# EAGLE design vixen1 (EAGLE 7.7.0)
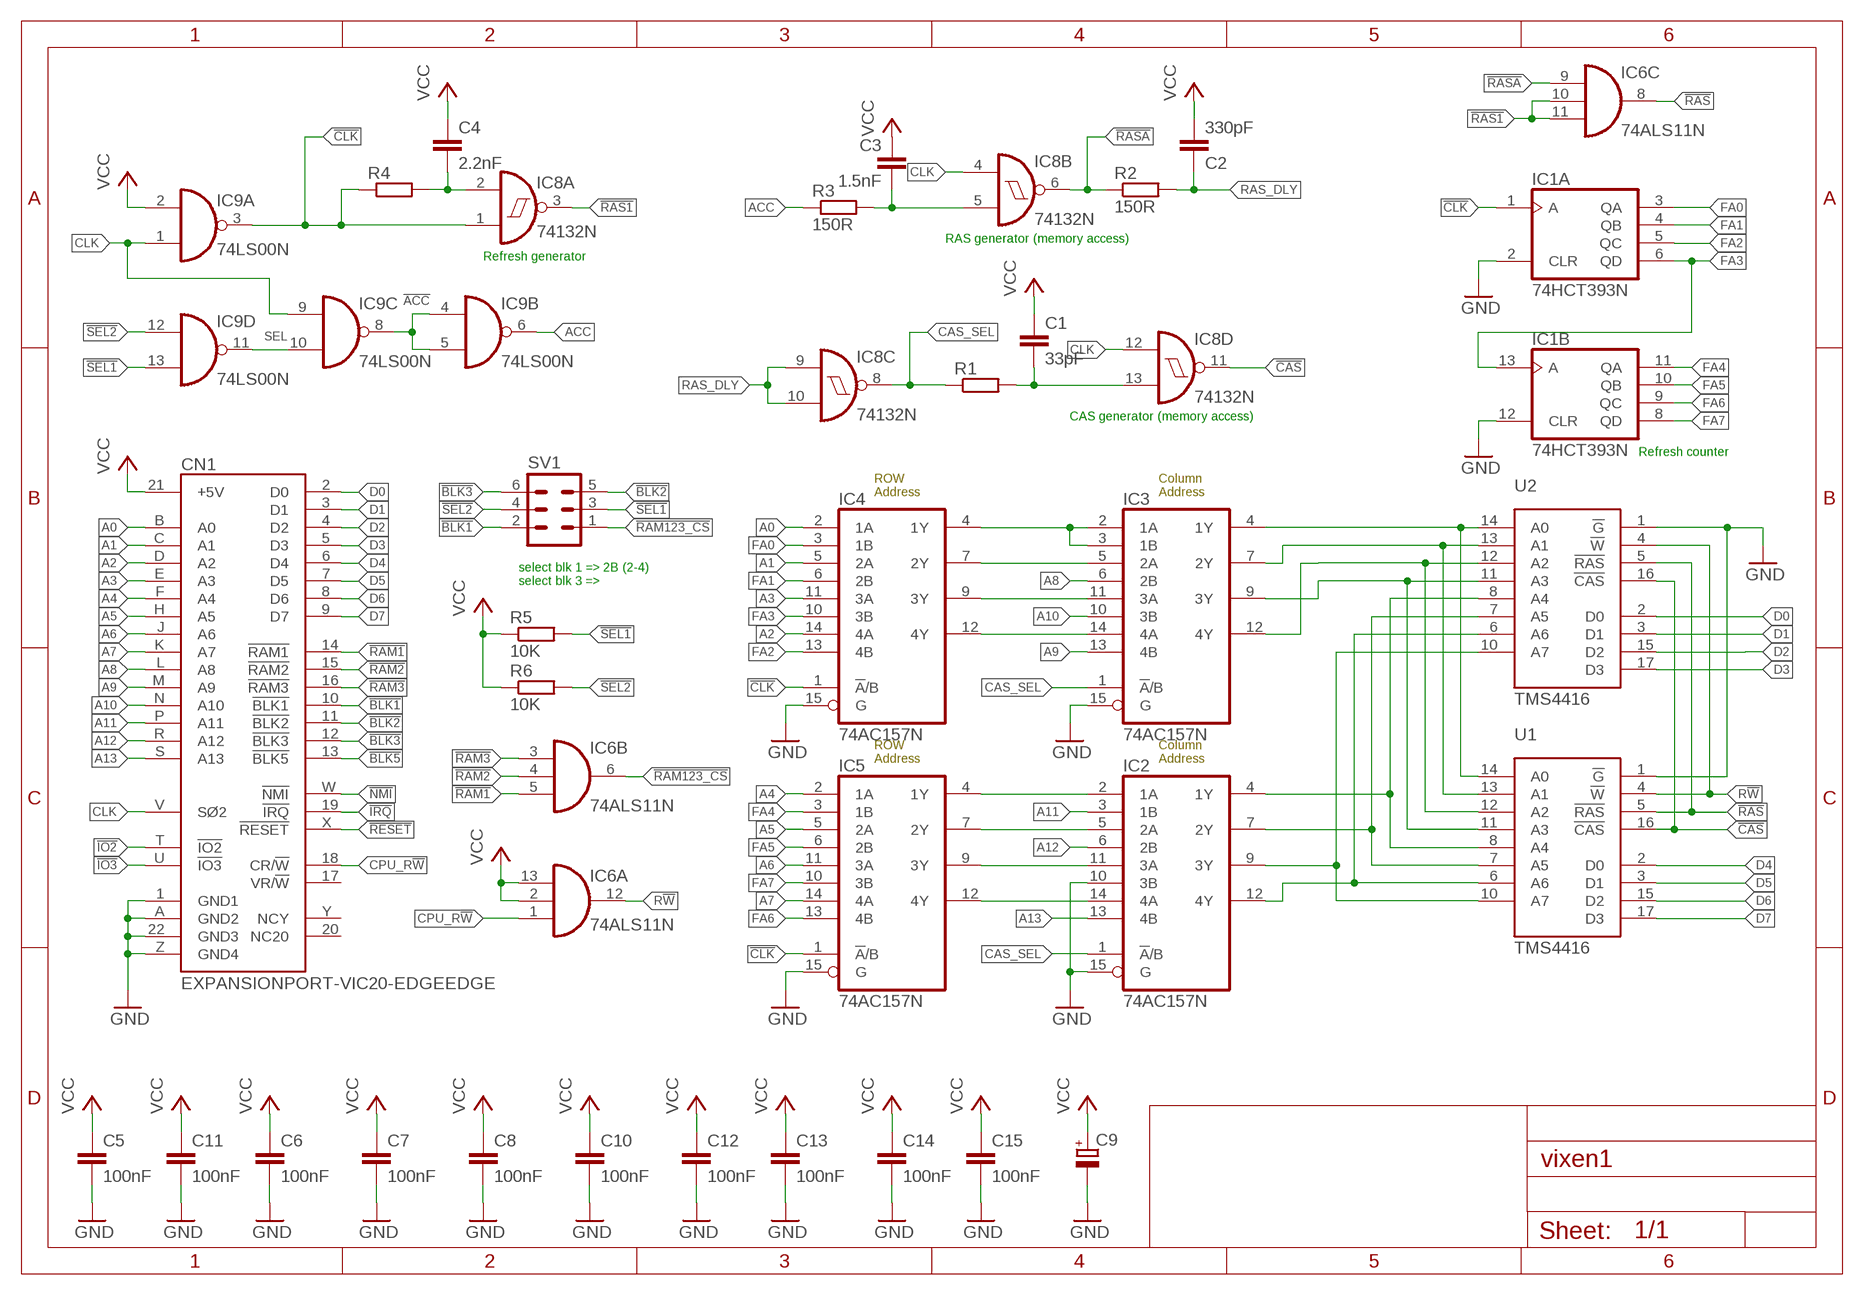
[diagram p0: schematic, sheet 1]

## Parts
C1  33pF  C-EU025-025X050  [C025-025X050]
C2  330pF  C-EU025-025X050  [C025-025X050]
C3  1.5nF  C-EU025-025X050  [C025-025X050]
C4  2.2nF  C-EU025-025X050  [C025-025X050]
C5  100nF  C-EU025-025X050  [C025-025X050]
C6  100nF  C-EU025-025X050  [C025-025X050]
C7  100nF  C-EU025-025X050  [C025-025X050]
C8  100nF  C-EU025-025X050  [C025-025X050]
C9  CPOL-EUE15-5AXIAL  [E15-5]
C10  100nF  C-EU025-025X050  [C025-025X050]
C11  100nF  C-EU025-025X050  [C025-025X050]
C12  100nF  C-EU025-025X050  [C025-025X050]
C13  100nF  C-EU025-025X050  [C025-025X050]
C14  100nF  C-EU025-025X050  [C025-025X050]
C15  100nF  C-EU025-025X050  [C025-025X050]
CN1  EXPANSIONPORT-VIC20-EDGEEDGE  [UPS44EDGE]
IC1  74HCT393N  [DIL14]
IC2  74AC157N  [DIL16]
IC3  74AC157N  [DIL16]
IC4  74AC157N  [DIL16]
IC5  74AC157N  [DIL16]
IC6  74ALS11N  [DIL14]
IC8  74132N  [DIL14]
IC9  74LS00N  [DIL14]
R1  R-EU_0204/7  [0204/7]
R2  150R  R-EU_0204/7  [0204/7]
R3  150R  R-EU_0204/7  [0204/7]
R4  R-EU_0204/7  [0204/7]
R5  10K  R-EU_0204/7  [0204/7]
R6  10K  R-EU_0204/7  [0204/7]
SV1  MA03-2  [MA03-2]
U1  TMS4416  [DIL18]
U2  TMS4416  [DIL18]

## Nets
!ACC: IC9.4(B:I0) IC9.5(B:I1) IC9.8(C:O)
!BLK1: CN1.10(!BLK1) SV1.2
!BLK2: CN1.11(!BLK2) SV1.5
!BLK3: CN1.12(!BLK3) SV1.6
!BLK5: CN1.13(!BLK5)
!CAS: IC8.11(D:O) U1.16(!CAS) U2.16(!CAS)
!CLK: IC1.1(A:A) IC4.1(!A!/B) IC5.1(!A!/B) IC8.1(A:I0) IC9.3(A:O) R4.1
!IO2: CN1.T(!IO2)
!IO3: CN1.U(!IO3)
!IRQ: CN1.19(!IRQ)
!NMI: CN1.W(!NMI)
!RAM1: CN1.14(!RAM1) IC6.5(B:I2)
!RAM2: CN1.15(!RAM2) IC6.4(B:I1)
!RAM3: CN1.16(!RAM3) IC6.3(B:I0)
!RAM123_CS: IC6.6(B:O) SV1.1
!RAS: IC6.8(C:O) U1.5(!RAS) U2.5(!RAS)
!RAS1: IC6.10(C:I1) IC6.11(C:I2) IC8.3(A:O)
!RASA: IC6.9(C:I0) IC8.6(B:O) R2.1
!RESET: CN1.X(!RESET)
!SEL1: IC9.13(D:I1) R5.2 SV1.3
!SEL2: IC9.12(D:I0) R6.2 SV1.4
A0: CN1.B(A0) IC4.2(1A)
A1: CN1.C(A1) IC4.5(2A)
A2: CN1.D(A2) IC4.14(4A)
A3: CN1.E(A3) IC4.11(3A)
A4: CN1.F(A4) IC5.2(1A)
A5: CN1.H(A5) IC5.5(2A)
A6: CN1.J(A6) IC5.11(3A)
A7: CN1.K(A7) IC5.14(4A)
A8: CN1.L(A8) IC3.6(2B)
A9: CN1.M(A9) IC3.13(4B)
A10: CN1.N(A10) IC3.10(3B)
A11: CN1.P(A11) IC2.3(1B)
A12: CN1.R(A12) IC2.6(2B)
A13: CN1.S(A13) IC2.13(4B)
ACC: IC9.6(B:O) R3.1
CAS_RC: C1.2 IC8.13(D:I1) R1.2
CAS_RC1: C4.2 IC8.2(A:I1) R4.2
CAS_SEL: IC2.1(!A!/B) IC3.1(!A!/B) IC8.8(C:O) R1.1
CLK: CN1.V(SØ2) IC8.4(B:I0) IC8.12(D:I0) IC9.1(A:I0) IC9.9(C:I0)
CPU_R!W: CN1.18(CR/!W) IC6.1(A:I0)
D0: CN1.2(D0) U2.2(D0)
D1: CN1.3(D1) U2.3(D1)
D2: CN1.4(D2) U2.15(D2)
D3: CN1.5(D3) U2.17(D3)
D4: CN1.6(D4) U1.2(D0)
D5: CN1.7(D5) U1.3(D1)
D6: CN1.8(D6) U1.15(D2)
D7: CN1.9(D7) U1.17(D3)
FA0: IC1.3(A:QA) IC4.3(1B)
FA1: IC1.4(A:QB) IC4.6(2B)
FA2: IC1.5(A:QC) IC4.13(4B)
FA3: IC1.6(A:QD) IC1.13(B:A) IC4.10(3B)
FA4: IC1.11(B:QA) IC5.3(1B)
FA5: IC1.10(B:QB) IC5.6(2B)
FA6: IC1.9(B:QC) IC5.13(4B)
FA7: IC1.8(B:QD) IC5.10(3B)
GND: C5.2 C6.2 C7.2 C8.2 C9.- C10.2 C11.2 C12.2 C13.2 C14.2 C15.2 CN1.1(GND1) CN1.22(GND3) CN1.A(GND2) CN1.Z(GND4) IC1.2(A:CLR) IC1.12(B:CLR) IC2.10(3B) IC2.15(G) IC3.15(G) IC4.15(G) IC5.15(G) U1.1(!G) U2.1(!G)
R!W: IC6.12(A:O) U1.4(!W) U2.4(!W)
RA0: IC3.4(1Y) U1.14(A0) U2.14(A0)
RA1: IC3.7(2Y) U1.13(A1) U2.13(A1)
RA2: IC3.12(4Y) U1.12(A2) U2.12(A2)
RA3: IC3.9(3Y) U1.11(A3) U2.11(A3)
RA4: IC2.4(1Y) U1.8(A4) U2.8(A4)
RA5: IC2.7(2Y) U1.7(A5) U2.7(A5)
RA6: IC2.12(4Y) U1.6(A6) U2.6(A6)
RA7: IC2.9(3Y) U1.10(A7) U2.10(A7)
RAS_DLY: C2.1 IC8.9(C:I0) IC8.10(C:I1) R2.2
RAS_RC1: C3.2 IC8.5(B:I1) R3.2
ROW0: IC3.2(1A) IC3.3(1B) IC4.4(1Y)
ROW1: IC3.5(2A) IC4.7(2Y)
ROW2: IC3.14(4A) IC4.12(4Y)
ROW3: IC3.11(3A) IC4.9(3Y)
ROW4: IC2.2(1A) IC5.4(1Y)
ROW5: IC2.5(2A) IC5.7(2Y)
ROW6: IC2.14(4A) IC5.12(4Y)
ROW7: IC2.11(3A) IC5.9(3Y)
SEL: IC9.10(C:I1) IC9.11(D:O)
VCC: C1.1 C2.2 C3.1 C4.1 C5.1 C6.1 C7.1 C8.1 C9.+ C10.1 C11.1 C12.1 C13.1 C14.1 C15.1 CN1.21(+5V) IC6.2(A:I1) IC6.13(A:I2) IC9.2(A:I1) R5.1 R6.1
Unconnected: CN1.17(VR/!W) CN1.20(NC20) CN1.Y(NCY)

## Notes on the sheet
- RAS generator (memory access)
- Refresh generator
- CAS generator (memory access)
- Refresh counter
- ROW
  Address
- Column
  Address
- select blk 1 => 2B (2-4)
  select blk 3 =>
- ROW
  Address
- Column
  Address

## Power pins joined to a net without a drawn wire
GND: IC1.7(P:GND) IC2.8(GND) IC3.8(GND) IC4.8(GND) IC5.8(GND) IC6.7(P:GND) IC8.7(P:GND) IC9.7(P:GND) U1.18(GND) U2.18(GND)
VCC: IC1.14(P:VCC) IC2.16(VCC) IC3.16(VCC) IC4.16(VCC) IC5.16(VCC) IC6.14(P:VCC) IC8.14(P:VCC) IC9.14(P:VCC) U1.9(VCC) U2.9(VCC)

## Library data of the parts
C1-C8 C10-C15 = rcl:C-EU: CAPACITOR, European symbol
C9 = rcl:CPOL-EU: POLARIZED CAPACITOR, European symbol
CN1 = 0RB_Commodore:EXPANSIONPORT-VIC20-EDGE: Expansionport of the Commodore VIC-20
IC1 = 74xx-eu:74*393: Dual 4-bit decade and binary COUNTER
IC2-IC5 = 74xx-eu:74*157: Quadruple 2-line to 1-line data SELECTOR/MULTIPLEXER
IC6 = 74xx-eu:74*11: Triple 3-input AND gate
IC8 = 74xx-eu:74*132: Quad 2-input NAND schmitt trigger
IC9 = 74xx-eu:74*00: Quad 2-input NAND gate
R1-R6 = rcl:R-EU_: RESISTOR, European symbol
SV1 = con-lstb:MA03-2: PIN HEADER; OC_FARNELL: unknown; OC_NEWARK: unknown
U1 U2 = tms4416:TMS4416

## Board
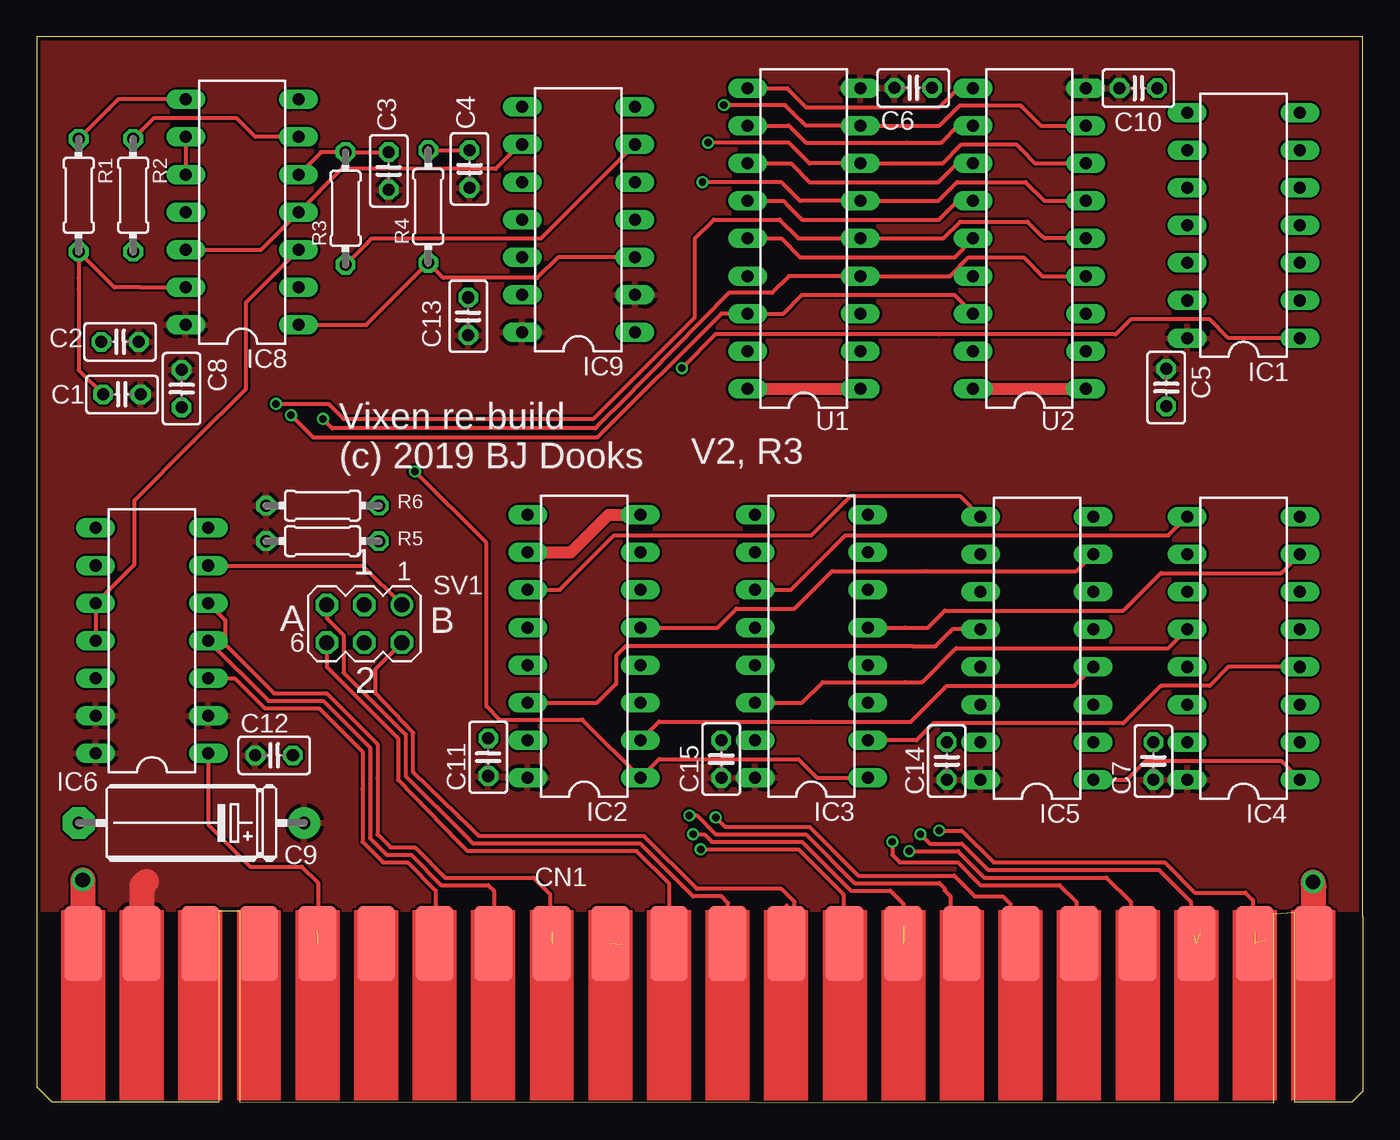
[diagram p1: board, top side]
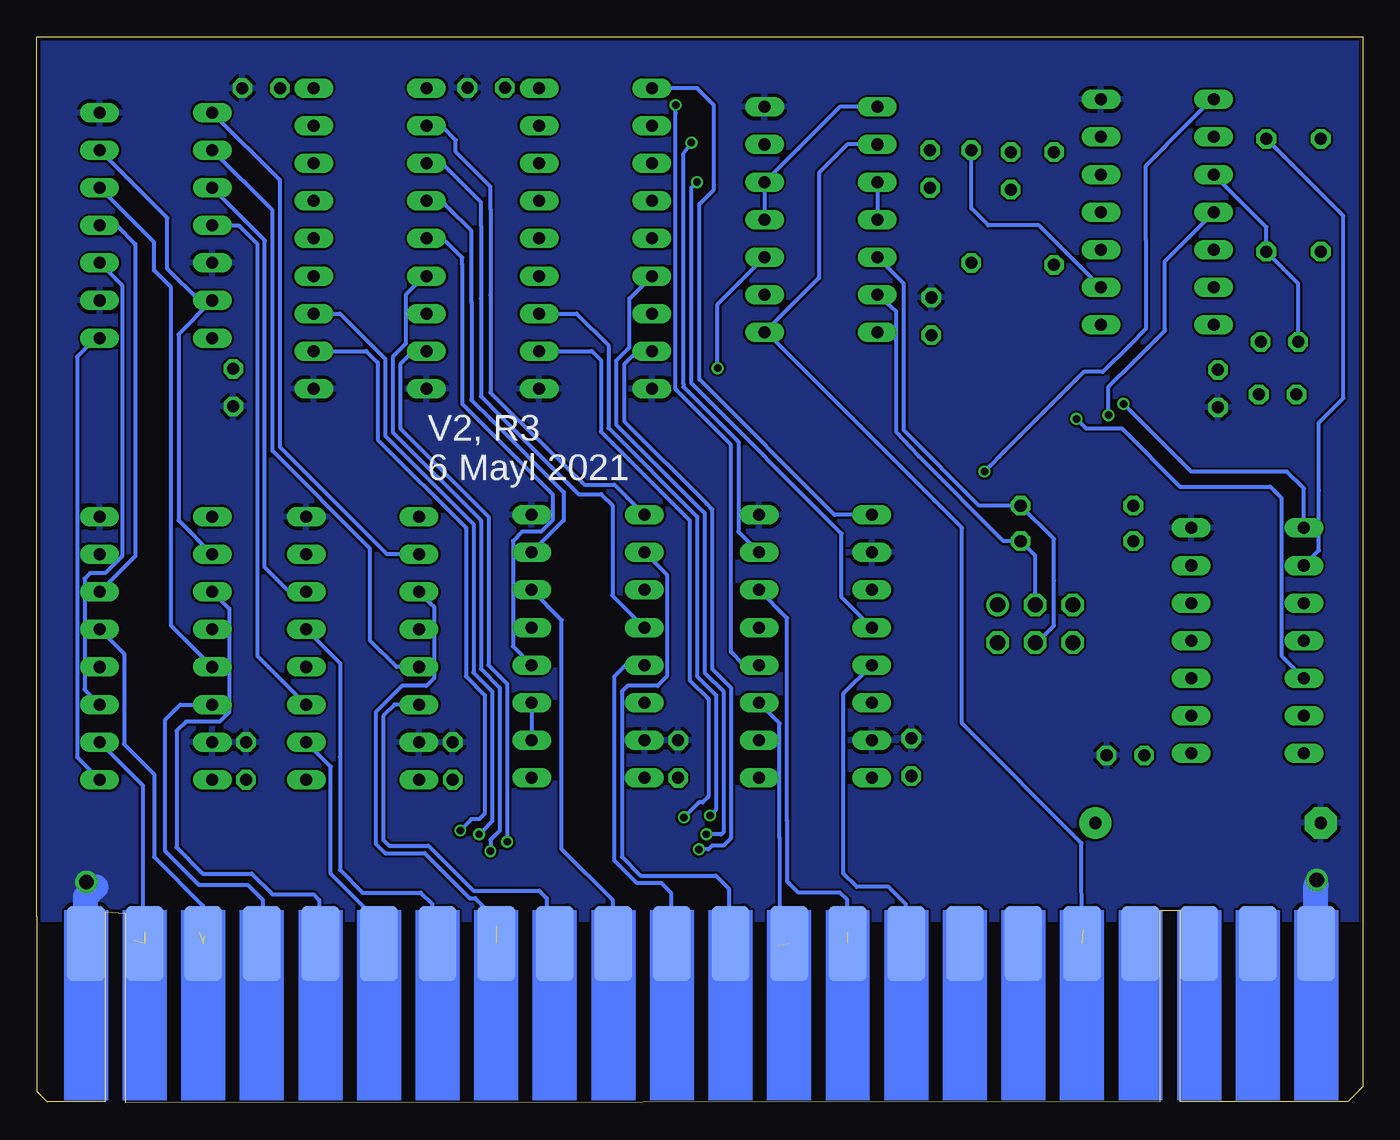
[diagram p2: board, bottom side, seen from below]

Size 89.6 x 72.03 mm. Coordinates in mm from the lower left corner, seen from the top.
Outline: 89.6,12.57 89.6,72.03 0,72.03 0,12.72
Copper layers (1*16): Top 0.035mm / dielectric 1.5mm / Bottom 0.035mm
Design rules "Elecrow_2-layer_eagle_rule *": minimum track width 6mil, minimum drill 12mil, track to track 6mil, track to pad 6mil, pad to pad 6mil, via to via 6mil, smd to smd 0mil, copper to edge 10mil, drill to drill 10mil, minimum pad ring 10mil, minimum via ring 6mil, stop-mask expansion 2mil, vias tented up to drill 100mil, thermal gap 10mil

### Footprints (pad centres in the part's own frame; a part is rotated, then mirrored left to right if it is on the bottom)
C025-025X050 = drill 0.813 octagon: 1 -1.27,0; 2 1.27,0
E15-5 = drill 0.813 pad 2.159: + -7.62,0 | drill 0.813 pad 2.159 octagon: - 7.62,0
UPS44EDGE = smd 2.54 x 5.08: 1 41.581,3.68; 2 37.621,3.68; 3 33.661,3.68; 4 29.701,3.68; 5 25.741,3.68; 6 21.781,3.68; 7 17.821,3.68; 8 13.861,3.68; 9 9.901,3.68; 10 5.941,3.68; 11 1.981,3.68; 12 -1.979,3.68; 13 -5.939,3.68; 14 -9.899,3.68; 15 -13.859,3.68; 16 -17.819,3.68; 17 -21.779,3.68; 18 -25.739,3.68; 19 -29.699,3.68; 20 -33.659,3.68; 21 -37.619,3.68; 22 -41.579,3.68 | smd 2.54 x 5.08 bottom: A 41.581,3.68; B 37.621,3.68; C 33.661,3.68; D 29.701,3.68; E 25.741,3.68; F 21.781,3.68; H 17.821,3.68; J 13.861,3.68; K 9.901,3.68; L 5.941,3.68; M 1.981,3.68; N -1.979,3.68; P -5.939,3.68; R -9.899,3.68; S -13.859,3.68; T -17.819,3.68; U -21.779,3.68; V -25.739,3.68; W -29.699,3.68; X -33.659,3.68; Y -37.619,3.68; Z -41.579,3.68
DIL14 = drill 0.813 long: 1 -7.62,-3.81; 2 -5.08,-3.81; 3 -2.54,-3.81; 4 0,-3.81; 5 2.54,-3.81; 6 5.08,-3.81; 7 7.62,-3.81; 8 7.62,3.81; 9 5.08,3.81; 10 2.54,3.81; 11 0,3.81; 12 -2.54,3.81; 13 -5.08,3.81; 14 -7.62,3.81
DIL16 = drill 0.813 long: 1 -8.89,-3.81; 2 -6.35,-3.81; 3 -3.81,-3.81; 4 -1.27,-3.81; 5 1.27,-3.81; 6 3.81,-3.81; 7 6.35,-3.81; 8 8.89,-3.81; 9 8.89,3.81; 10 6.35,3.81; 11 3.81,3.81; 12 1.27,3.81; 13 -1.27,3.81; 14 -3.81,3.81; 15 -6.35,3.81; 16 -8.89,3.81
0204/7 = drill 0.813 octagon: 1 -3.81,0; 2 3.81,0
MA03-2 = drill 1.016: 1 -2.54,-1.27 | drill 1.016 octagon: 2 -2.54,1.27; 3 0,-1.27; 4 0,1.27; 5 2.54,-1.27; 6 2.54,1.27
DIL18 = drill 0.813 long: 1 -10.16,-3.81; 2 -7.62,-3.81; 3 -5.08,-3.81; 4 -2.54,-3.81; 5 0,-3.81; 6 2.54,-3.81; 7 5.08,-3.81; 8 7.62,-3.81; 9 10.16,-3.81; 10 10.16,3.81; 11 7.62,3.81; 12 5.08,3.81; 13 2.54,3.81; 14 0,3.81; 15 -2.54,3.81; 16 -5.08,3.81; 17 -7.62,3.81; 18 -10.16,3.81

### Placement (x,y rotation side)
C1  5.74,47.88 180 top
C2  5.61,51.43 0 top
C3  23.78,62.99 90 top
C4  29.24,63.12 90 top
C5  76.33,48.34 270 top
C6  59.24,68.59 0 top
C7  75.46,23.11 90 top
C8  9.78,48.27 270 top
C9  10.44,18.92 180 top
C10  74.45,68.58 0 top
C11  30.51,23.37 90 top
C12  16.03,23.49 0 top
C13  29.15,53.16 90 top
C14  61.49,23.11 90 top
C15  46.25,23.24 90 top
CN1  44.7,7.1 0 top
IC1  81.56,59.31 90 top
IC2  36.98,30.86 90 top
IC3  52.35,30.86 90 top
IC4  81.56,30.73 90 top
IC5  67.59,30.73 90 top
IC6  7.77,31.24 90 top
IC8  13.87,60.2 90 top
IC9  36.6,59.69 90 top
R1  2.82,61.34 270 top
R2  6.5,61.34 270 top
R3  20.85,60.45 90 top
R4  26.44,60.58 90 top
R5  19.3,37.97 0 top
R6  19.3,40.37 0 top
SV1  22.12,32.38 180 top
U1  51.84,58.42 90 top
U2  67.08,58.42 90 top

### Tracks (layer width: path | path; a pad name or v marks a point on that pad's centre or on a via)
!ACC
  Bottom 0.254: IC9.4 IC9.5 38.13,64.51 36.35,66.29 35.33,67.31 IC9.8
!BLK1
  Top 0.254: CN1.10 50.67,13.36 50.67,12.6 51.21,12.06 51.21,13.59 50.32,14.47 44.6,14.47 41.05,18.03 29.87,18.03 29.36,18.54 25.43,22.35 25.43,25.02 22.89,27.68 22.89,29.33 SV1.2
!BLK2
  Top 0.254: SV1.5 19.58,32.76 20.73,31.62 20.73,29.08 24.92,24.89 24.92,22.09 28.86,18.16 29.49,17.52 40.79,17.52 44.35,13.97 46.25,13.97 46.71,13.51 CN1.11
!BLK3
  Top 0.254: SV1.6 19.58,29.46 24.41,24.63 24.41,21.84 28.47,17.65 29.11,17.02 40.54,17.02 42.75,14.8 CN1.12 42.83,10.86
!CAS  (via drill 0.5)
  Top 0.254: 18.7,44.95 18.57,45.08 | 18.57,45.08 v17.17,46.48 | 18.7,44.95 37.87,44.95 46.25,53.34 U1.16 50.45,53.34 51.72,54.61 62,54.61 U2.16 | 18.7,44.95 18.57,45.08
  Bottom 0.254: v17.17,46.48 17.17,48.38 15.39,50.16 15.27,50.29 13.36,52.19 13.36,56.89 IC8.11
!CLK  (via drill 0.5)
  Top 0.254: IC8.1 22.25,52.57 R4.1 27.46,55.75 33.81,55.75 35.21,57.15 IC9.3 | IC1.1 80.54,51.69 79.27,52.96 73.94,52.96 72.92,51.94 60.99,51.94 45.87,51.94 v43.59,49.65 | IC5.1 73.69,21.84 74.83,22.98 74.96,23.11 84.1,23.11 IC4.1
  Bottom 0.254: v43.59,49.65 43.59,53.97 IC9.3 | IC1.1 85.62,51.69 86.89,50.42 86.89,23.37 IC4.1
!RAM1  (1 unrouted)
  Top 0.254: IC6.5 12.73,32.64 12.73,30.98 16.03,27.68 19.58,27.68 23.01,24.25 23.01,21.97 23.01,18.16 23.9,17.27 25.55,17.27 27.59,15.24 33.55,15.24 34.7,14.09 34.7,11.68 34.82,11.55
!RAM2
  Top 0.254: IC6.4 15.65,27.17 19.33,27.17 22.51,24 22.51,21.59 22.51,17.9 23.52,16.89 23.65,16.76 25.3,16.76 27.33,14.73 30.51,14.73 30.89,14.35 30.89,11.68 31.4,11.17 31,11.17 30.87,11.3 | CN1.15 30.87,11.3 | 30.87,11.3 30.87,13.22
!RAM3
  Top 0.254: IC6.3 13.36,28.7 15.39,26.67 19.08,26.67 22,23.75 22,21.21 22,17.65 23.39,16.25 25.05,16.25 26.95,14.35 26.95,11.55 26.82,11.43 26.82,10.88 CN1.16
!RAM123_CS
  Top 0.254: IC6.6 22,36.32 SV1.1
!RAS  (via drill 0.5)
  Top 0.254: U2.5 68.1,58.42 67.97,58.54 66.95,59.56 62.41,59.56 61.26,58.42 U1.5 51.46,58.42 50.19,59.69 45.75,59.69 44.48,58.42 44.48,53.08 38.63,47.24 37.62,46.22 20.73,46.22 19.71,47.24 v16.16,47.24
  Bottom 0.254: IC6.8 3.96,41.53 5.11,42.67 11.58,42.67 v16.16,47.24
!RAS1
  Top 0.254: IC6.11 IC6.10 6.6,36.42 6.6,40.73 10.57,44.7 14.12,48.26 14.12,54.1 IC8.3
!RASA
  Top 0.254: IC8.6 14.76,65.28 13.49,66.55 7.9,66.55 R2.1
  Bottom 0.254: IC6.9 2.95,37.34 2.95,41.4 2.95,45.97 1.93,46.99 1.3,47.62 1.3,59.94 R2.1
!SEL1
  Bottom 0.254: IC9.13 31.52,53.46 31.52,45.34 30,43.68 24.28,37.97 R5.2 22.12,36.98 SV1.3
!SEL2
  Bottom 0.254: SV1.4 22,31.11 20.85,32.25 20.85,35.3 20.85,38.11 R6.2 25.92,40.37 31.01,45.46 31.01,55.37 IC9.12
A0  (1 unrouted)
  Bottom 0.254: IC4.2 82.45,21.46 82.45,11.68 83.08,11.05
A1  (1 unrouted)
  Bottom 0.254: IC4.5 83.72,30.35 83.72,24.25 81.69,22.22 81.69,16.63 78.39,13.33 78.39,11.43 78.51,11.3 78.26,11.3 | CN1.C 78.39,10.79 78.77,10.41
A2
  Bottom 0.254: CN1.D 74.32,10.9 74.32,13.71 75.34,14.73 78.64,14.73 80.92,17.02 80.92,25.91 79.91,26.92 IC4.14
A3
  Bottom 0.254: IC4.11 76.61,33.4 76.61,26.41 77.24,25.78 79.53,25.78 80.16,25.14 80.16,17.27 78.39,15.49 75.08,15.49 73.69,14.09 70.89,14.09 70.51,13.71 70.51,10.83 CN1.E
A4
  Bottom 0.254: CN1.F 66.7,10.98 66.7,12.44 69.5,15.24 69.75,15.49 69.75,22.73 IC5.2
A5
  Bottom 0.254: IC5.5 69.11,29.71 69.11,23.37 69.11,15.74 67.59,14.22 63.65,14.22 62.89,13.46 62.89,12.19 | 62.89,12.19 62.51,12.57 62.76,12.82 | 62.89,12.19 63.02,12.06 63.02,11.26 CN1.H
A6  (1 unrouted)
  Bottom 0.254: IC5.11 63.02,33.78 62.76,33.52 62.76,28.7 63.27,28.19 64.92,28.19 66.7,26.41 66.7,17.52 66.07,16.89 63.4,16.89 60.35,13.84 59.97,13.84 58.57,12.44 58.57,11.93
A7
  Bottom 0.254: IC5.14 65.43,26.92 66.19,26.16 66.19,17.78 65.81,17.4 63.14,17.4 61.11,15.36 60.1,14.35 55.65,14.35 55.14,13.84 55.14,11.81 54.64,11.3 54.76,11.3 54.76,10.92 CN1.K
A8
  Bottom 0.254: CN1.L 50.67,13.68 54.13,17.14 54.13,32.64 IC3.6
A9
  Bottom 0.254: CN1.M 46.71,14.17 47.4,14.86 49.05,14.86 50.57,16.38 50.57,28.83 49.81,29.59 IC3.13
A10
  Bottom 0.254: IC3.10 47.02,35.68 47.02,28.83 47.65,28.19 49.68,28.19 50.06,27.81 50.06,16.63 48.79,15.36 43.71,15.36 42.83,14.47 42.83,11.93 42.95,11.81 42.95,10.99 CN1.N
A11  (1 unrouted)
  Bottom 0.254: IC2.3 39.4,25.65 39.4,17.9 39.4,11.43 39.78,11.05 39.78,10.92 39.52,10.66
A12
  Bottom 0.254: CN1.R 34.83,13.34 34.83,13.72 35.33,14.22 38.13,14.22 38.76,14.86 38.89,14.98 38.89,19.05 38.89,32.76 IC2.6
A13
  Bottom 0.254: CN1.S 30.87,13.44 32.03,14.6 34.19,14.6 35.08,15.49 35.08,27.68 IC2.13
ACC
  Top 0.254: IC9.6 38,62.35 36.09,60.45 34.06,58.42 22.63,58.42 22.38,58.16 R3.1
CAS_RC
  Top 0.254: C1.2 2.82,49.53 2.82,54.99 2.82,55.75 R1.2 5.23,55.11 7.01,55.11 IC8.13
CAS_RC1
  Top 0.254: R4.2 C4.2
  Bottom 0.254: IC8.2 21.87,59.31 25.3,59.31 26.44,60.45 R4.2
CAS_SEL  (via drill 0.5)
  Top 0.254: IC3.1 52.73,21.97 51.46,23.24 47.4,23.24 42.06,23.24 IC2.1 36.86,25.91 31.27,25.91 30.38,26.79 30.38,37.84 v25.55,42.67 | R1.1 4.85,67.18 | 4.85,67.18 5.23,67.56 | IC8.8 5.49,67.81 4.85,67.18
  Bottom 0.254: IC8.8 10.19,67.81 13.23,64.77 13.23,64.74 14.6,63.37 14.63,63.34 14.63,58.29 14.63,52.32 15.77,51.18 17.55,49.4 18.82,49.4 24.54,43.68 25.05,43.18 25.17,43.05 v25.55,42.67
CLK
  Top 0.254: IC9.9 32.67,64.77 31.01,63.12 20.6,63.12 IC8.4 15.14,57.65 IC8.12
  Bottom 0.254: IC9.9 34.82,64.77 35.59,64.01 36.73,62.86 36.73,55.75 IC9.1 40.29,52.07 29.17,40.95 | 29.17,40.95 28.86,40.64 | CN1.V 18.99,17.56 27.08,25.65 27.08,38.86 29.17,40.95
CPU_R!W  (1 unrouted)
  Top 0.254: IC6.1 11.58,18.79 14.4,15.97 17.9,15.97 19,14.87 19,12.47 18.9,12.37 18.9,11.67
D0  (via drill 0.5)  (1 unrouted)
  Top 0.254: v60.99,18.41 62.51,18.41 64.67,16.25 76.23,16.25 78.26,14.22 81.69,14.22 82.2,13.71 82.2,11.68 82.32,11.55
  Bottom 0.254: U2.2 67.34,50.8 66.57,50.03 66.57,44.83 60.61,38.86 60.61,28.83 59.34,27.56 59.34,19.55 59.72,19.17 60.22,19.17 v60.99,18.41
D1  (via drill 0.5)  (1 unrouted)
  Top 0.254: v59.72,18.16 60.35,17.52 62.51,17.52 64.29,15.74 75.84,15.74 78,13.59 78,12.19 78.64,11.55
  Bottom 0.254: U2.3 69.11,53.34 66.07,50.29 66.07,45.08 60.1,39.11 60.1,29.08 58.83,27.81 58.83,19.05 59.46,18.41 v59.72,18.16
D2  (via drill 0.5)
  Top 0.254: v58.95,17.02 62.26,17.02 64.03,15.24 72.29,15.24 73.94,13.59 73.94,11.28 CN1.4
  Bottom 0.254: U2.15 63.4,55.88 64.67,54.61 64.67,51.3 65.56,50.42 65.56,49.91 65.56,49.65 65.56,45.34 59.59,39.37 59.59,29.33 58.32,28.06 58.32,18.41 58.95,17.78 v58.95,17.02
D3  (via drill 0.5)
  Top 0.254: v57.81,17.65 57.81,16.76 58.32,16.25 62.26,16.25 63.78,14.73 69.11,14.73 70.26,13.59 70.26,11 CN1.5
  Bottom 0.254: U2.17 64.16,50.8 65.05,49.91 65.05,45.59 59.08,39.62 59.08,29.59 57.81,28.32 v57.81,17.65
D4  (via drill 0.5)
  Top 0.254: v45.87,19.3 46.38,18.79 46.51,18.67 52.22,18.67 55.53,15.36 62,15.36 63.4,13.97 65.3,13.97 65.81,13.46 65.81,11.3 66.95,10.16 66.95,10.34 CN1.6
  Bottom 0.254: U1.2 52.1,50.8 51.49,50.19 51.49,45.36 45.49,39.37 45.49,28.57 44.22,27.3 44.22,20.7 44.6,20.32 44.86,20.32 v45.87,19.3
D5  (via drill 0.5)
  Top 0.254: v44.1,19.43 44.6,19.43 45.87,18.16 51.97,18.16 55.27,14.86 60.99,14.86 61.37,14.47 61.37,14.35 61.75,13.97 61.75,11.93 62.38,11.3 62.38,10.96 CN1.7
  Bottom 0.254: U1.3 53.11,53.34 50.98,51.2 50.98,45.62 44.98,39.62 44.98,28.83 43.71,27.56 43.71,19.81 v44.1,19.43
D6  (via drill 0.5)
  Top 0.254: v44.35,18.16 45.11,18.16 45.62,17.65 51.72,17.65 55.02,14.35 57.68,14.35 58.57,13.46 58.57,11.55 58.57,11.43 58.57,10.81 CN1.8
  Bottom 0.254: v44.35,18.16 43.33,18.16 43.21,18.28 43.21,27.81 44.48,29.08 44.48,39.88 44.6,40 50.45,45.84 50.45,50.16 49.56,51.05 49.56,54.35 U1.15
D7  (via drill 0.5)
  Top 0.254: v44.86,17.14 51.46,17.14 54.51,14.09 54.51,12.19 53.75,11.43 53.99,11.43 CN1.9
  Bottom 0.254: U1.17 49.02,50.8 49.91,49.91 49.91,46.07 44.35,40.51 43.97,40.13 43.97,29.33 42.7,28.06 42.7,17.9 43.21,17.4 43.97,17.4 44.22,17.14 v44.86,17.14
FA0
  Bottom 0.254: IC1.3 84.23,55.62 83.85,55.24 83.85,36.95 84.99,35.81 86.01,35.81 86.39,35.43 86.39,27.94 IC4.3
FA1
  Bottom 0.254: IC1.4 84.23,59.31 82.96,58.04 82.96,36.95 IC4.6
FA2
  Bottom 0.254: IC4.13 80.54,32.25 80.54,38.99 80.54,55.11 81.69,56.26 81.69,58.16 IC1.5
FA3
  Bottom 0.254: IC1.6 80.8,59.81 80.8,56.38 78.64,54.23 IC1.13 80.04,51.94 80.04,39.37 IC4.10
FA4
  Bottom 0.254: IC1.11 75.97,59.31 74.83,58.16 74.7,58.04 74.7,30.22 IC5.3
FA5
  Bottom 0.254: IC5.6 72.54,34.54 74.19,36.19 74.19,58.29 IC1.10
FA6
  Bottom 0.254: IC5.13 65.3,29.46 67.08,31.24 67.08,37.46 73.69,44.07 73.69,60.32 IC1.9
FA7
  Bottom 0.254: IC5.10 65.94,37.08 73.18,44.32 73.18,62.35 IC1.8
GND  (via drill 1)
  Top 0.813: U2.18 U2.1 | U1.18 U1.1 | IC2.10 33.3,37.21 36.09,37.21 38.63,39.75 IC2.8
  Top 1.676: CN1.A 86.31,14.68 v86.26,14.93 | CN1.22 3.12,15.05 v3.1,15.07
  Bottom 1.016: CN1.A 86.31,11.25 86.01,11.55
  Bottom 1.676: CN1.A 86.31,13.91 85.62,14.6 | CN1.22 3.15,14.73
  pour Bottom: -6.07,83.69 103.15,83.69 103.66,18.54 104.04,12.44 -5.18,12.44
R!W  (via drill 0.5)
  Top 0.254: U2.4 67.97,55.88 66.7,57.15 62.97,57.15 61.7,55.88 U1.4 50.83,55.88 49.68,54.73 46.76,54.73 39.4,47.24 38.38,46.22 37.87,45.72 37.75,45.59 19.97,45.59 v19.33,46.22
  Bottom 0.254: v19.33,46.22 18.7,45.59 16.28,45.59 12.35,41.65 6.25,41.65 5.49,40.89 5.49,30.22 IC6.12
RA0
  Top 0.254: U1.14 50.32,58.42 51.59,57.15 62.04,57.15 63.31,58.42 U2.14
  Bottom 0.254: IC3.4 57.43,30.86 57.43,37.97 56.8,38.6 55.53,38.6 54.76,39.37 54.76,41.14 59.59,45.97 60.86,47.24 60.86,53.84 60.86,56.65 60.86,57.13 62.1,58.37 63.23,58.37 U2.14
RA1
  Top 0.254: U1.13 50.45,60.96 50.83,60.58 51.72,59.69 60.98,59.69 62.25,60.96 U2.13
  Bottom 0.254: IC3.7 54,39.37 54,41.27 58.95,46.22 60.22,47.49 60.22,54.1 60.22,58.93 61.73,60.44 62.25,60.96 U2.13
RA2
  Top 0.254: U1.12 50.95,63.5 52.22,62.23 60.95,62.23 62.22,63.5 U2.12
  Bottom 0.254: IC3.12 50.7,34.29 50.7,40.38 51.46,41.14 52.98,41.14 58.32,46.48 59.59,47.75 59.59,54.35 59.59,59.31 59.59,60.87 61.74,63.03 62.22,63.5 U2.12
RA3
  Top 0.254: U1.11 50.83,66.04 51.97,64.89 58.83,64.89 61.12,64.89 62.3,66.07 63.24,66.07 U2.11
  Bottom 0.254: IC3.9 49.68,40.89 50.57,41.78 52.6,41.78 57.68,46.73 58.95,48 58.95,54.61 58.95,60.39 58.95,61.72 58.95,61.92 59.8,62.77 61.3,64.27 61.3,65.07 62.15,65.92 63.16,65.92 U2.11
RA4  (via drill 0.5)
  Top 0.254: U2.8 67.84,66.04 66.57,67.31 66.47,67.41 62.38,67.41 61.11,66.14 61.01,66.04 U1.8 51.97,66.04 51.08,66.93 50.57,67.43 v46.44,67.43
  Bottom 0.254: 40.67,29.59 IC2.4 41.81,29.59 42.7,30.48 42.7,44.49 46.44,48.23 46.44,66.9 v46.44,67.43
RA5  (via drill 0.5)
  Top 0.254: 66.19,64.77 66.5,64.47 | 66.5,64.47 67.46,63.5 U2.7 | v45.37,64.89 50.83,64.89 51.08,64.64 52.22,63.5 U1.7 58.7,63.5 61.23,63.5 62.5,64.77 66.19,64.77 66.5,64.47
  Bottom 0.254: v45.37,64.89 45.9,64.13 45.9,48.61 45.9,48.38 42.19,44.67 42.19,38.6 IC2.7
RA6  (via drill 0.5)
  Top 0.254: U2.6 68.1,60.96 66.83,62.23 62.2,62.23 60.93,60.96 U1.6 51.59,60.96 50.57,61.97 50.32,62.23 v44.98,62.23
  Bottom 0.254: IC2.12 35.21,34.16 35.21,38.48 45.37,48.64 45.37,61.85 v44.98,62.23
RA7
  Top 0.254: U1.10 50.7,68.58 51.84,67.43 52,67.27 61,67.27 62.3,68.57 U2.10
  Bottom 0.254: 47.91,68.58 U1.10 44.98,68.58 44.1,67.69 43.84,67.43 43.84,61.72 44.83,60.73 44.83,48.89 35.69,39.75 33.3,39.75 IC2.9
RAS_DLY
  Top 0.254: IC8.9 IC8.10
  Bottom 0.254: IC8.10 6.5,59.18 R2.2 4.34,55.37 C2.1
RAS_RC1
  Top 0.254: C3.2 R3.2 19.2,64.26 IC8.5
ROW0
  Top 0.254: IC4.4 80.54,29.46 79.27,28.19 75.97,28.19 73.43,25.65 60.61,25.65 59.46,24.51 IC3.2
  Bottom 0.254: IC3.3 IC3.2
ROW1
  Top 0.254: IC3.5 58.7,32.13 60.22,32.13 61.37,33.27 73.43,33.27 75.97,35.81 84.1,35.81 IC4.7
ROW2
  Top 0.254: IC3.14 51.72,27.05 53.11,28.45 58.7,28.45 59.84,28.45 62.13,30.73 76.48,30.73 IC4.12
ROW3
  Top 0.254: IC3.11 50.95,34.67 52.22,35.94 54.64,38.35 58.45,38.35 76.48,38.35 IC4.9
ROW4
  Top 0.254: IC2.2 42.06,25.78 52.35,25.78 59.08,25.78 61.37,28.06 61.49,28.19 70.13,28.19 IC5.4
ROW5
  Top 0.254: IC2.5 46,32.13 47.27,33.4 51.21,33.4 53.75,35.94 60.1,35.94 70.26,35.94 IC5.7
ROW6
  Top 0.254: IC2.14 37.87,27.05 39.14,28.32 39.14,30.22 39.78,30.86 59.21,30.86 60.73,30.86 61.75,31.87 61.88,32 IC5.12
ROW7
  Top 0.254: IC2.11 35.33,34.67 39.02,38.35 52.35,38.35 55.02,41.02 62.38,41.02 IC5.9
SEL
  Bottom 0.254: IC9.10 IC9.11
VCC
  Top 1.676: CN1.21 7.11,14.7 7.39,14.98
  pour Top: -6.2,84.96 101.63,84.96 102.13,13.08 -5.69,13.08

### Text on the board
tNames: Vixen re-build / (c) 2019 BJ Dooks | V2, R3 | 1 | A | B | 2
bNames: V2, R3 / 6 Mayl 2021